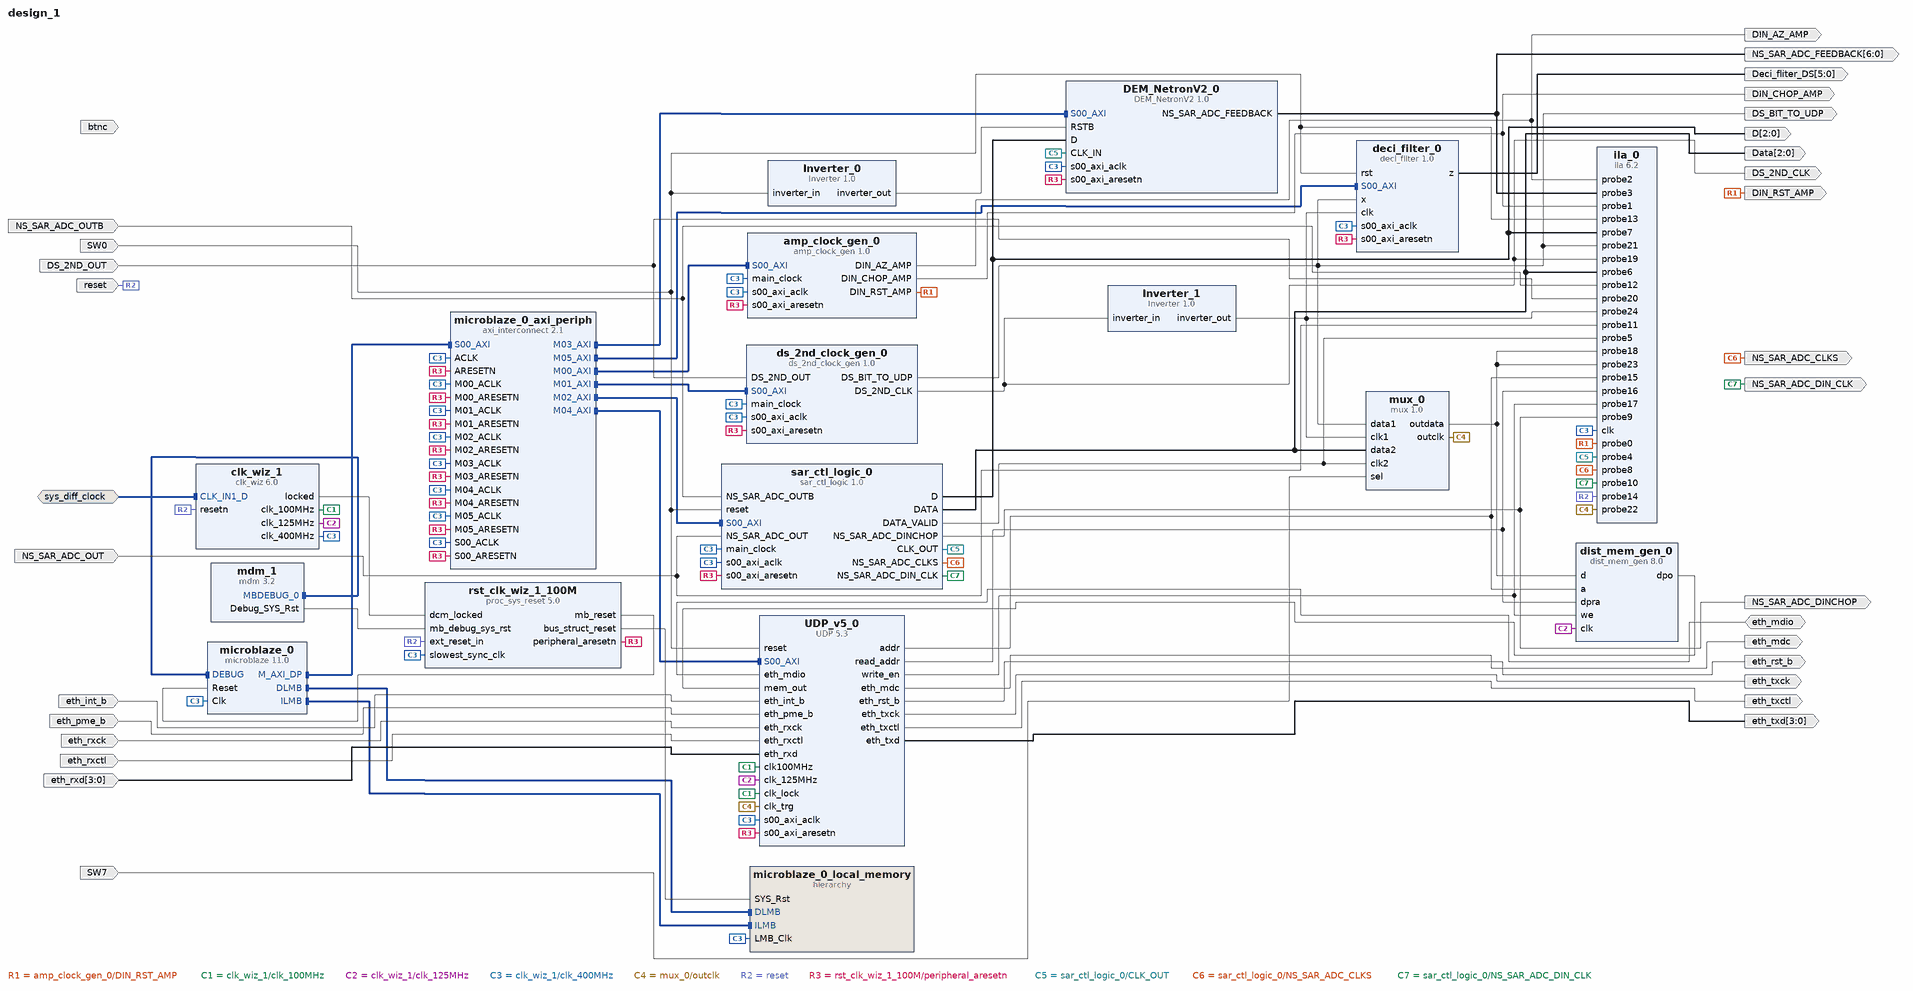
[diagram p0: block diagram of the top level]
# Vivado block design design_1, xc7k325tffg900-2, Vivado 2023.2
create_bd_design design_1

create_bd_intf_port -mode Slave -vlnv xilinx.com:interface:diff_clock_rtl:1.0 sys_diff_clock
set_property -dict {CONFIG.FREQ_HZ 200000000} [get_bd_intf_ports sys_diff_clock]
create_bd_port -dir O DIN_RST_AMP
create_bd_port -dir O DIN_CHOP_AMP
create_bd_port -dir O DIN_AZ_AMP
create_bd_port -dir I -type rst reset
set_property -dict {CONFIG.POLARITY ACTIVE_LOW} [get_bd_ports reset]
create_bd_port -dir I DS_2ND_OUT
create_bd_port -dir O DS_2ND_CLK
create_bd_port -dir O DS_BIT_TO_UDP
create_bd_port -dir I NS_SAR_ADC_OUT
create_bd_port -dir I NS_SAR_ADC_OUTB
create_bd_port -dir O -from 2 -to 0 Data
create_bd_port -dir O -from 2 -to 0 D
create_bd_port -dir O NS_SAR_ADC_CLKS
create_bd_port -dir O NS_SAR_ADC_DINCHOP
create_bd_port -dir O NS_SAR_ADC_DIN_CLK
create_bd_port -dir O -from 6 -to 0 NS_SAR_ADC_FEEDBACK
create_bd_port -dir O eth_rst_b
create_bd_port -dir O eth_mdc
create_bd_port -dir IO eth_mdio
create_bd_port -dir O eth_txck
create_bd_port -dir O eth_txctl
create_bd_port -dir O -from 3 -to 0 eth_txd
create_bd_port -dir I eth_int_b
create_bd_port -dir I eth_pme_b
create_bd_port -dir I eth_rxck
create_bd_port -dir I eth_rxctl
create_bd_port -dir I -from 3 -to 0 eth_rxd
create_bd_port -dir I btnc
create_bd_port -dir I SW7
create_bd_port -dir I SW0
create_bd_port -dir O -from 5 -to 0 Deci_fliter_DS

create_bd_cell -type ip -vlnv xilinx.com:ip:microblaze:11.0 microblaze_0
set_property -dict {CONFIG.C_DEBUG_ENABLED 1 CONFIG.C_D_AXI 1 CONFIG.C_D_LMB 1 CONFIG.C_I_LMB 1} [get_bd_cells microblaze_0]
create_bd_cell -type hier microblaze_0_local_memory
create_bd_cell -type ip -vlnv xilinx.com:ip:mdm:3.2 mdm_1
create_bd_cell -type ip -vlnv xilinx.com:ip:clk_wiz:6.0 clk_wiz_1
set_property -dict [list \
  CONFIG.CLKIN1_JITTER_PS 50.0 \
  CONFIG.CLKOUT1_JITTER 112.316 \
  CONFIG.CLKOUT1_PHASE_ERROR 89.971 \
  CONFIG.CLKOUT1_REQUESTED_OUT_FREQ 100 \
  CONFIG.CLKOUT1_USED true \
  CONFIG.CLKOUT2_JITTER 112.316 \
  CONFIG.CLKOUT2_PHASE_ERROR 89.971 \
  CONFIG.CLKOUT2_REQUESTED_OUT_FREQ 100.000 \
  CONFIG.CLKOUT2_USED true \
  CONFIG.CLKOUT3_JITTER 107.523 \
  CONFIG.CLKOUT3_PHASE_ERROR 89.971 \
  CONFIG.CLKOUT3_REQUESTED_OUT_FREQ 125 \
  CONFIG.CLKOUT3_USED true \
  CONFIG.CLKOUT4_JITTER 178.053 \
  CONFIG.CLKOUT4_PHASE_ERROR 89.971 \
  CONFIG.CLKOUT4_REQUESTED_OUT_FREQ 10 \
  CONFIG.CLKOUT4_USED true \
  CONFIG.CLK_IN1_BOARD_INTERFACE sys_diff_clock \
  CONFIG.CLK_OUT1_PORT clk_400MHz \
  CONFIG.CLK_OUT2_PORT clk_100MHz \
  CONFIG.CLK_OUT3_PORT clk_125MHz \
  CONFIG.CLK_OUT4_PORT clk_10MHz \
  CONFIG.MMCM_CLKFBOUT_MULT_F 5.000 \
  CONFIG.MMCM_CLKIN1_PERIOD 5.000 \
  CONFIG.MMCM_CLKIN2_PERIOD 10.0 \
  CONFIG.MMCM_CLKOUT0_DIVIDE_F 10.000 \
  CONFIG.MMCM_CLKOUT1_DIVIDE 10 \
  CONFIG.MMCM_CLKOUT2_DIVIDE 8 \
  CONFIG.MMCM_CLKOUT3_DIVIDE 100 \
  CONFIG.NUM_OUT_CLKS 4 \
  CONFIG.PRIM_SOURCE Differential_clock_capable_pin \
  CONFIG.RESET_BOARD_INTERFACE reset \
  CONFIG.RESET_PORT resetn \
  CONFIG.RESET_TYPE ACTIVE_LOW \
  CONFIG.USE_BOARD_FLOW true \
  CONFIG.USE_POWER_DOWN false \
] [get_bd_cells clk_wiz_1]
create_bd_cell -type ip -vlnv xilinx.com:ip:proc_sys_reset:5.0 rst_clk_wiz_1_100M
set_property -dict {CONFIG.RESET_BOARD_INTERFACE reset CONFIG.USE_BOARD_FLOW true} [get_bd_cells rst_clk_wiz_1_100M]
create_bd_cell -type ip -vlnv xilinx.com:ip:axi_interconnect:2.1 microblaze_0_axi_periph
set_property -dict {CONFIG.NUM_MI 6} [get_bd_cells microblaze_0_axi_periph]
create_bd_cell -type ip -vlnv xilinx.com:user:ds_2nd_clock_gen:1.0 ds_2nd_clock_gen_0
create_bd_cell -type ip -vlnv xilinx.com:user:amp_clock_gen:1.0 amp_clock_gen_0
create_bd_cell -type ip -vlnv xilinx.com:user:sar_ctl_logic:1.0 sar_ctl_logic_0
create_bd_cell -type ip -vlnv xilinx.com:user:DEM_NetronV2:1.0 DEM_NetronV2_0
create_bd_cell -type ip -vlnv xilinx.com:user:UDP:5.3 UDP_v5_0
create_bd_cell -type ip -vlnv xilinx.com:ip:dist_mem_gen:8.0 dist_mem_gen_0
set_property -dict {CONFIG.data_width 8 CONFIG.depth 8192 CONFIG.memory_type simple_dual_port_ram} [get_bd_cells dist_mem_gen_0]
create_bd_cell -type ip -vlnv xilinx.com:ip:ila:6.2 ila_0
set_property -dict [list \
  CONFIG.C_DATA_DEPTH 65536 \
  CONFIG.C_MONITOR_TYPE Native \
  CONFIG.C_NUM_OF_PROBES 25 \
  CONFIG.C_PROBE15_WIDTH 13 \
  CONFIG.C_PROBE16_WIDTH 13 \
  CONFIG.C_PROBE18_WIDTH 8 \
  CONFIG.C_PROBE23_WIDTH 8 \
  CONFIG.C_PROBE3_WIDTH 7 \
  CONFIG.C_PROBE6_WIDTH 3 \
  CONFIG.C_PROBE7_WIDTH 3 \
] [get_bd_cells ila_0]
create_bd_cell -type ip -vlnv xilinx.com:user:mux:1.0 mux_0
create_bd_cell -type ip -vlnv xilinx.com:user:Inverter:1.0 Inverter_0
create_bd_cell -type ip -vlnv xilinx.com:user:Inverter:1.0 Inverter_1
create_bd_cell -type ip -vlnv xilinx.com:user:deci_filter:1.0 deci_filter_0

# ---- hierarchy /microblaze_0_local_memory ----
current_bd_instance /microblaze_0_local_memory
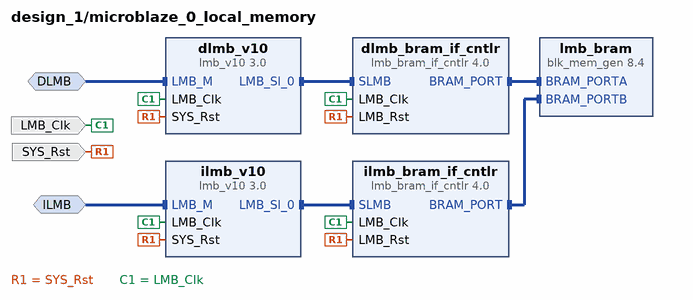
[diagram p1: block diagram inside /microblaze_0_local_memory]
create_bd_intf_pin -mode MirroredMaster -vlnv xilinx.com:interface:lmb_rtl:1.0 DLMB
create_bd_intf_pin -mode MirroredMaster -vlnv xilinx.com:interface:lmb_rtl:1.0 ILMB
create_bd_pin -dir I -type clk LMB_Clk
create_bd_pin -dir I -type rst SYS_Rst

create_bd_cell -type ip -vlnv xilinx.com:ip:lmb_v10:3.0 dlmb_v10
create_bd_cell -type ip -vlnv xilinx.com:ip:lmb_v10:3.0 ilmb_v10
create_bd_cell -type ip -vlnv xilinx.com:ip:lmb_bram_if_cntlr:4.0 dlmb_bram_if_cntlr
set_property -dict {CONFIG.C_ECC 0} [get_bd_cells dlmb_bram_if_cntlr]
create_bd_cell -type ip -vlnv xilinx.com:ip:lmb_bram_if_cntlr:4.0 ilmb_bram_if_cntlr
set_property -dict {CONFIG.C_ECC 0} [get_bd_cells ilmb_bram_if_cntlr]
create_bd_cell -type ip -vlnv xilinx.com:ip:blk_mem_gen:8.4 lmb_bram
set_property -dict {CONFIG.Memory_Type True_Dual_Port_RAM CONFIG.use_bram_block BRAM_Controller} [get_bd_cells lmb_bram]

# ---- connections ----

current_bd_instance /microblaze_0_local_memory
connect_bd_intf_net -intf_net microblaze_0_dlmb [get_bd_intf_pins dlmb_v10/LMB_M] [get_bd_intf_pins DLMB]
connect_bd_intf_net -intf_net microblaze_0_dlmb_bus [get_bd_intf_pins dlmb_v10/LMB_Sl_0] [get_bd_intf_pins dlmb_bram_if_cntlr/SLMB]
connect_bd_intf_net -intf_net microblaze_0_dlmb_cntlr [get_bd_intf_pins dlmb_bram_if_cntlr/BRAM_PORT] [get_bd_intf_pins lmb_bram/BRAM_PORTA]
connect_bd_intf_net -intf_net microblaze_0_ilmb [get_bd_intf_pins ilmb_v10/LMB_M] [get_bd_intf_pins ILMB]
connect_bd_intf_net -intf_net microblaze_0_ilmb_bus [get_bd_intf_pins ilmb_v10/LMB_Sl_0] [get_bd_intf_pins ilmb_bram_if_cntlr/SLMB]
connect_bd_intf_net -intf_net microblaze_0_ilmb_cntlr [get_bd_intf_pins ilmb_bram_if_cntlr/BRAM_PORT] [get_bd_intf_pins lmb_bram/BRAM_PORTB]
connect_bd_net [get_bd_pins SYS_Rst] \
  [get_bd_pins dlmb_v10/SYS_Rst] [get_bd_pins dlmb_bram_if_cntlr/LMB_Rst] [get_bd_pins ilmb_v10/SYS_Rst] \
  [get_bd_pins ilmb_bram_if_cntlr/LMB_Rst]
connect_bd_net -net microblaze_0_Clk [get_bd_pins LMB_Clk] \
  [get_bd_pins dlmb_v10/LMB_Clk] [get_bd_pins dlmb_bram_if_cntlr/LMB_Clk] [get_bd_pins ilmb_v10/LMB_Clk] \
  [get_bd_pins ilmb_bram_if_cntlr/LMB_Clk]
set_property HDL_ATTRIBUTE.BMM_INFO_ADDRESS_SPACE {byte  0x00000000 32 > design_1 microblaze_0_local_memory/lmb_bram} [get_bd_cells dlmb_bram_if_cntlr]
set_property HDL_ATTRIBUTE.KEEP_HIERARCHY yes [get_bd_cells dlmb_bram_if_cntlr]

current_bd_instance /
connect_bd_intf_net [get_bd_intf_pins microblaze_0/M_AXI_DP] [get_bd_intf_pins microblaze_0_axi_periph/S00_AXI]
connect_bd_intf_net [get_bd_intf_pins microblaze_0_axi_periph/M00_AXI] [get_bd_intf_pins amp_clock_gen_0/S00_AXI]
connect_bd_intf_net [get_bd_intf_pins microblaze_0_axi_periph/M01_AXI] [get_bd_intf_pins ds_2nd_clock_gen_0/S00_AXI]
connect_bd_intf_net [get_bd_intf_pins microblaze_0_axi_periph/M02_AXI] [get_bd_intf_pins sar_ctl_logic_0/S00_AXI]
connect_bd_intf_net [get_bd_intf_pins microblaze_0_axi_periph/M03_AXI] [get_bd_intf_pins DEM_NetronV2_0/S00_AXI]
connect_bd_intf_net [get_bd_intf_pins microblaze_0_axi_periph/M04_AXI] [get_bd_intf_pins UDP_v5_0/S00_AXI]
connect_bd_intf_net [get_bd_intf_pins microblaze_0_axi_periph/M05_AXI] [get_bd_intf_pins deci_filter_0/S00_AXI]
connect_bd_intf_net [get_bd_intf_pins mdm_1/MBDEBUG_0] [get_bd_intf_pins microblaze_0/DEBUG]
connect_bd_intf_net [get_bd_intf_pins microblaze_0/DLMB] [get_bd_intf_pins microblaze_0_local_memory/DLMB]
connect_bd_intf_net [get_bd_intf_pins microblaze_0/ILMB] [get_bd_intf_pins microblaze_0_local_memory/ILMB]
connect_bd_intf_net [get_bd_intf_ports sys_diff_clock] [get_bd_intf_pins clk_wiz_1/CLK_IN1_D]
connect_bd_net [get_bd_pins DEM_NetronV2_0/NS_SAR_ADC_FEEDBACK] [get_bd_ports NS_SAR_ADC_FEEDBACK] [get_bd_pins ila_0/probe3]
connect_bd_net [get_bd_ports DS_2ND_OUT] [get_bd_pins ila_0/probe20] [get_bd_pins ds_2nd_clock_gen_0/DS_2ND_OUT]
connect_bd_net [get_bd_pins Inverter_0/inverter_out] [get_bd_pins DEM_NetronV2_0/RSTB]
connect_bd_net [get_bd_pins Inverter_1/inverter_out] [get_bd_pins mux_0/clk1] [get_bd_pins ila_0/probe24] [get_bd_pins deci_filter_0/clk]
connect_bd_net [get_bd_ports NS_SAR_ADC_OUTB] [get_bd_pins ila_0/probe12] [get_bd_pins sar_ctl_logic_0/NS_SAR_ADC_OUTB]
connect_bd_net [get_bd_ports NS_SAR_ADC_OUT] [get_bd_pins ila_0/probe11] [get_bd_pins sar_ctl_logic_0/NS_SAR_ADC_OUT]
connect_bd_net [get_bd_ports eth_mdio] [get_bd_pins UDP_v5_0/eth_mdio]
connect_bd_net -net SW0_1 [get_bd_ports SW0] \
  [get_bd_pins UDP_v5_0/reset] [get_bd_pins ila_0/probe13] [get_bd_pins Inverter_0/inverter_in] \
  [get_bd_pins sar_ctl_logic_0/reset] [get_bd_pins deci_filter_0/rst]
connect_bd_net -net SW7_1 [get_bd_ports SW7] [get_bd_pins mux_0/sel]
connect_bd_net [get_bd_pins UDP_v5_0/addr] [get_bd_pins dist_mem_gen_0/a] [get_bd_pins ila_0/probe15]
connect_bd_net [get_bd_pins UDP_v5_0/eth_mdc] [get_bd_ports eth_mdc]
connect_bd_net [get_bd_pins UDP_v5_0/eth_rst_b] [get_bd_ports eth_rst_b]
connect_bd_net [get_bd_pins UDP_v5_0/eth_txck] [get_bd_ports eth_txck]
connect_bd_net [get_bd_pins UDP_v5_0/eth_txctl] [get_bd_ports eth_txctl]
connect_bd_net [get_bd_pins UDP_v5_0/eth_txd] [get_bd_ports eth_txd]
connect_bd_net [get_bd_pins UDP_v5_0/read_addr] [get_bd_pins dist_mem_gen_0/dpra] [get_bd_pins ila_0/probe16]
connect_bd_net [get_bd_pins UDP_v5_0/write_en] [get_bd_pins dist_mem_gen_0/we] [get_bd_pins ila_0/probe17]
connect_bd_net [get_bd_pins amp_clock_gen_0/DIN_AZ_AMP] [get_bd_ports DIN_AZ_AMP] [get_bd_pins ila_0/probe2]
connect_bd_net [get_bd_pins amp_clock_gen_0/DIN_CHOP_AMP] [get_bd_ports DIN_CHOP_AMP] [get_bd_pins ila_0/probe1]
connect_bd_net [get_bd_pins amp_clock_gen_0/DIN_RST_AMP] [get_bd_ports DIN_RST_AMP] [get_bd_pins ila_0/probe0]
connect_bd_net [get_bd_pins clk_wiz_1/clk_100MHz] [get_bd_pins UDP_v5_0/clk100MHz] [get_bd_pins UDP_v5_0/clk_lock]
connect_bd_net [get_bd_pins clk_wiz_1/clk_125MHz] [get_bd_pins dist_mem_gen_0/clk] [get_bd_pins UDP_v5_0/clk_125MHz]
connect_bd_net [get_bd_pins clk_wiz_1/locked] [get_bd_pins rst_clk_wiz_1_100M/dcm_locked]
connect_bd_net [get_bd_pins deci_filter_0/z] [get_bd_ports Deci_fliter_DS]
connect_bd_net [get_bd_pins dist_mem_gen_0/dpo] [get_bd_pins UDP_v5_0/mem_out]
connect_bd_net [get_bd_pins ds_2nd_clock_gen_0/DS_2ND_CLK] [get_bd_ports DS_2ND_CLK] [get_bd_pins ila_0/probe19] [get_bd_pins Inverter_1/inverter_in]
connect_bd_net [get_bd_pins ds_2nd_clock_gen_0/DS_BIT_TO_UDP] \
  [get_bd_ports DS_BIT_TO_UDP] [get_bd_pins ila_0/probe21] [get_bd_pins mux_0/data1] [get_bd_pins deci_filter_0/x]
connect_bd_net [get_bd_ports eth_int_b] [get_bd_pins UDP_v5_0/eth_int_b]
connect_bd_net [get_bd_ports eth_pme_b] [get_bd_pins UDP_v5_0/eth_pme_b]
connect_bd_net [get_bd_ports eth_rxck] [get_bd_pins UDP_v5_0/eth_rxck]
connect_bd_net [get_bd_ports eth_rxctl] [get_bd_pins UDP_v5_0/eth_rxctl]
connect_bd_net [get_bd_ports eth_rxd] [get_bd_pins UDP_v5_0/eth_rxd]
connect_bd_net [get_bd_pins mdm_1/Debug_SYS_Rst] [get_bd_pins rst_clk_wiz_1_100M/mb_debug_sys_rst]
connect_bd_net -net microblaze_0_Clk [get_bd_pins clk_wiz_1/clk_400MHz] \
  [get_bd_pins microblaze_0/Clk] [get_bd_pins microblaze_0_local_memory/LMB_Clk] \
  [get_bd_pins rst_clk_wiz_1_100M/slowest_sync_clk] [get_bd_pins microblaze_0_axi_periph/S00_ACLK] \
  [get_bd_pins microblaze_0_axi_periph/M00_ACLK] [get_bd_pins microblaze_0_axi_periph/ACLK] \
  [get_bd_pins microblaze_0_axi_periph/M01_ACLK] [get_bd_pins microblaze_0_axi_periph/M02_ACLK] \
  [get_bd_pins amp_clock_gen_0/main_clock] [get_bd_pins amp_clock_gen_0/s00_axi_aclk] \
  [get_bd_pins DEM_NetronV2_0/s00_axi_aclk] [get_bd_pins microblaze_0_axi_periph/M03_ACLK] \
  [get_bd_pins microblaze_0_axi_periph/M04_ACLK] [get_bd_pins UDP_v5_0/s00_axi_aclk] [get_bd_pins ila_0/clk] \
  [get_bd_pins ds_2nd_clock_gen_0/main_clock] [get_bd_pins ds_2nd_clock_gen_0/s00_axi_aclk] \
  [get_bd_pins sar_ctl_logic_0/main_clock] [get_bd_pins sar_ctl_logic_0/s00_axi_aclk] \
  [get_bd_pins deci_filter_0/s00_axi_aclk] [get_bd_pins microblaze_0_axi_periph/M05_ACLK]
connect_bd_net [get_bd_pins mux_0/outclk] [get_bd_pins ila_0/probe22] [get_bd_pins UDP_v5_0/clk_trg]
connect_bd_net [get_bd_pins mux_0/outdata] [get_bd_pins ila_0/probe23] [get_bd_pins dist_mem_gen_0/d] [get_bd_pins ila_0/probe18]
connect_bd_net [get_bd_ports reset] [get_bd_pins clk_wiz_1/resetn] [get_bd_pins rst_clk_wiz_1_100M/ext_reset_in] [get_bd_pins ila_0/probe14]
connect_bd_net [get_bd_pins rst_clk_wiz_1_100M/bus_struct_reset] [get_bd_pins microblaze_0_local_memory/SYS_Rst]
connect_bd_net [get_bd_pins rst_clk_wiz_1_100M/mb_reset] [get_bd_pins microblaze_0/Reset]
connect_bd_net [get_bd_pins rst_clk_wiz_1_100M/peripheral_aresetn] \
  [get_bd_pins microblaze_0_axi_periph/S00_ARESETN] [get_bd_pins microblaze_0_axi_periph/M00_ARESETN] \
  [get_bd_pins microblaze_0_axi_periph/ARESETN] [get_bd_pins microblaze_0_axi_periph/M01_ARESETN] \
  [get_bd_pins microblaze_0_axi_periph/M02_ARESETN] [get_bd_pins amp_clock_gen_0/s00_axi_aresetn] \
  [get_bd_pins DEM_NetronV2_0/s00_axi_aresetn] [get_bd_pins microblaze_0_axi_periph/M03_ARESETN] \
  [get_bd_pins microblaze_0_axi_periph/M04_ARESETN] [get_bd_pins UDP_v5_0/s00_axi_aresetn] \
  [get_bd_pins ds_2nd_clock_gen_0/s00_axi_aresetn] [get_bd_pins sar_ctl_logic_0/s00_axi_aresetn] \
  [get_bd_pins deci_filter_0/s00_axi_aresetn] [get_bd_pins microblaze_0_axi_periph/M05_ARESETN]
connect_bd_net [get_bd_pins sar_ctl_logic_0/CLK_OUT] [get_bd_pins DEM_NetronV2_0/CLK_IN] [get_bd_pins ila_0/probe4]
connect_bd_net [get_bd_pins sar_ctl_logic_0/D] [get_bd_ports D] [get_bd_pins DEM_NetronV2_0/D] [get_bd_pins ila_0/probe7]
connect_bd_net [get_bd_pins sar_ctl_logic_0/DATA] [get_bd_ports Data] [get_bd_pins ila_0/probe6] [get_bd_pins mux_0/data2]
connect_bd_net [get_bd_pins sar_ctl_logic_0/DATA_VALID] [get_bd_pins ila_0/probe5] [get_bd_pins mux_0/clk2]
connect_bd_net [get_bd_pins sar_ctl_logic_0/NS_SAR_ADC_CLKS] [get_bd_ports NS_SAR_ADC_CLKS] [get_bd_pins ila_0/probe8]
connect_bd_net [get_bd_pins sar_ctl_logic_0/NS_SAR_ADC_DINCHOP] [get_bd_ports NS_SAR_ADC_DINCHOP] [get_bd_pins ila_0/probe9]
connect_bd_net [get_bd_pins sar_ctl_logic_0/NS_SAR_ADC_DIN_CLK] [get_bd_ports NS_SAR_ADC_DIN_CLK] [get_bd_pins ila_0/probe10]
set_property HDL_ATTRIBUTE.BMM_INFO_PROCESSOR {microblaze-le > design_1 microblaze_0_local_memory/dlmb_bram_if_cntlr} [get_bd_cells microblaze_0]
set_property HDL_ATTRIBUTE.KEEP_HIERARCHY yes [get_bd_cells microblaze_0]

# ---- address map ----
assign_bd_address -offset 0x00000000 -range 32K -target_address_space [get_bd_addr_spaces microblaze_0/Data] [get_bd_addr_segs microblaze_0_local_memory/dlmb_bram_if_cntlr/SLMB/Mem]
assign_bd_address -offset 0x44A00000 -range 64K -target_address_space [get_bd_addr_spaces microblaze_0/Data] [get_bd_addr_segs amp_clock_gen_0/S00_AXI/S00_AXI_reg]
assign_bd_address -offset 0x44A10000 -range 64K -target_address_space [get_bd_addr_spaces microblaze_0/Data] [get_bd_addr_segs ds_2nd_clock_gen_0/S00_AXI/S00_AXI_reg]
assign_bd_address -offset 0x44A20000 -range 64K -target_address_space [get_bd_addr_spaces microblaze_0/Data] [get_bd_addr_segs sar_ctl_logic_0/S00_AXI/S00_AXI_reg]
assign_bd_address -offset 0x44A30000 -range 64K -target_address_space [get_bd_addr_spaces microblaze_0/Data] [get_bd_addr_segs DEM_NetronV2_0/S00_AXI/S00_AXI_reg]
assign_bd_address -offset 0x44A40000 -range 64K -target_address_space [get_bd_addr_spaces microblaze_0/Data] [get_bd_addr_segs UDP_v5_0/S00_AXI/S00_AXI_reg]
assign_bd_address -offset 0x44A50000 -range 64K -target_address_space [get_bd_addr_spaces microblaze_0/Data] [get_bd_addr_segs deci_filter_0/S00_AXI/S00_AXI_reg]
assign_bd_address -offset 0x00000000 -range 32K -target_address_space [get_bd_addr_spaces microblaze_0/Instruction] [get_bd_addr_segs microblaze_0_local_memory/ilmb_bram_if_cntlr/SLMB/Mem]

validate_bd_design
save_bd_design
